# Altium project Serializer_Board.PrjPcb (part 2 of 2)

## Sheet FPGA_Bank.SchDoc
size A2; SheetNumber: 6; SheetTotal: 6
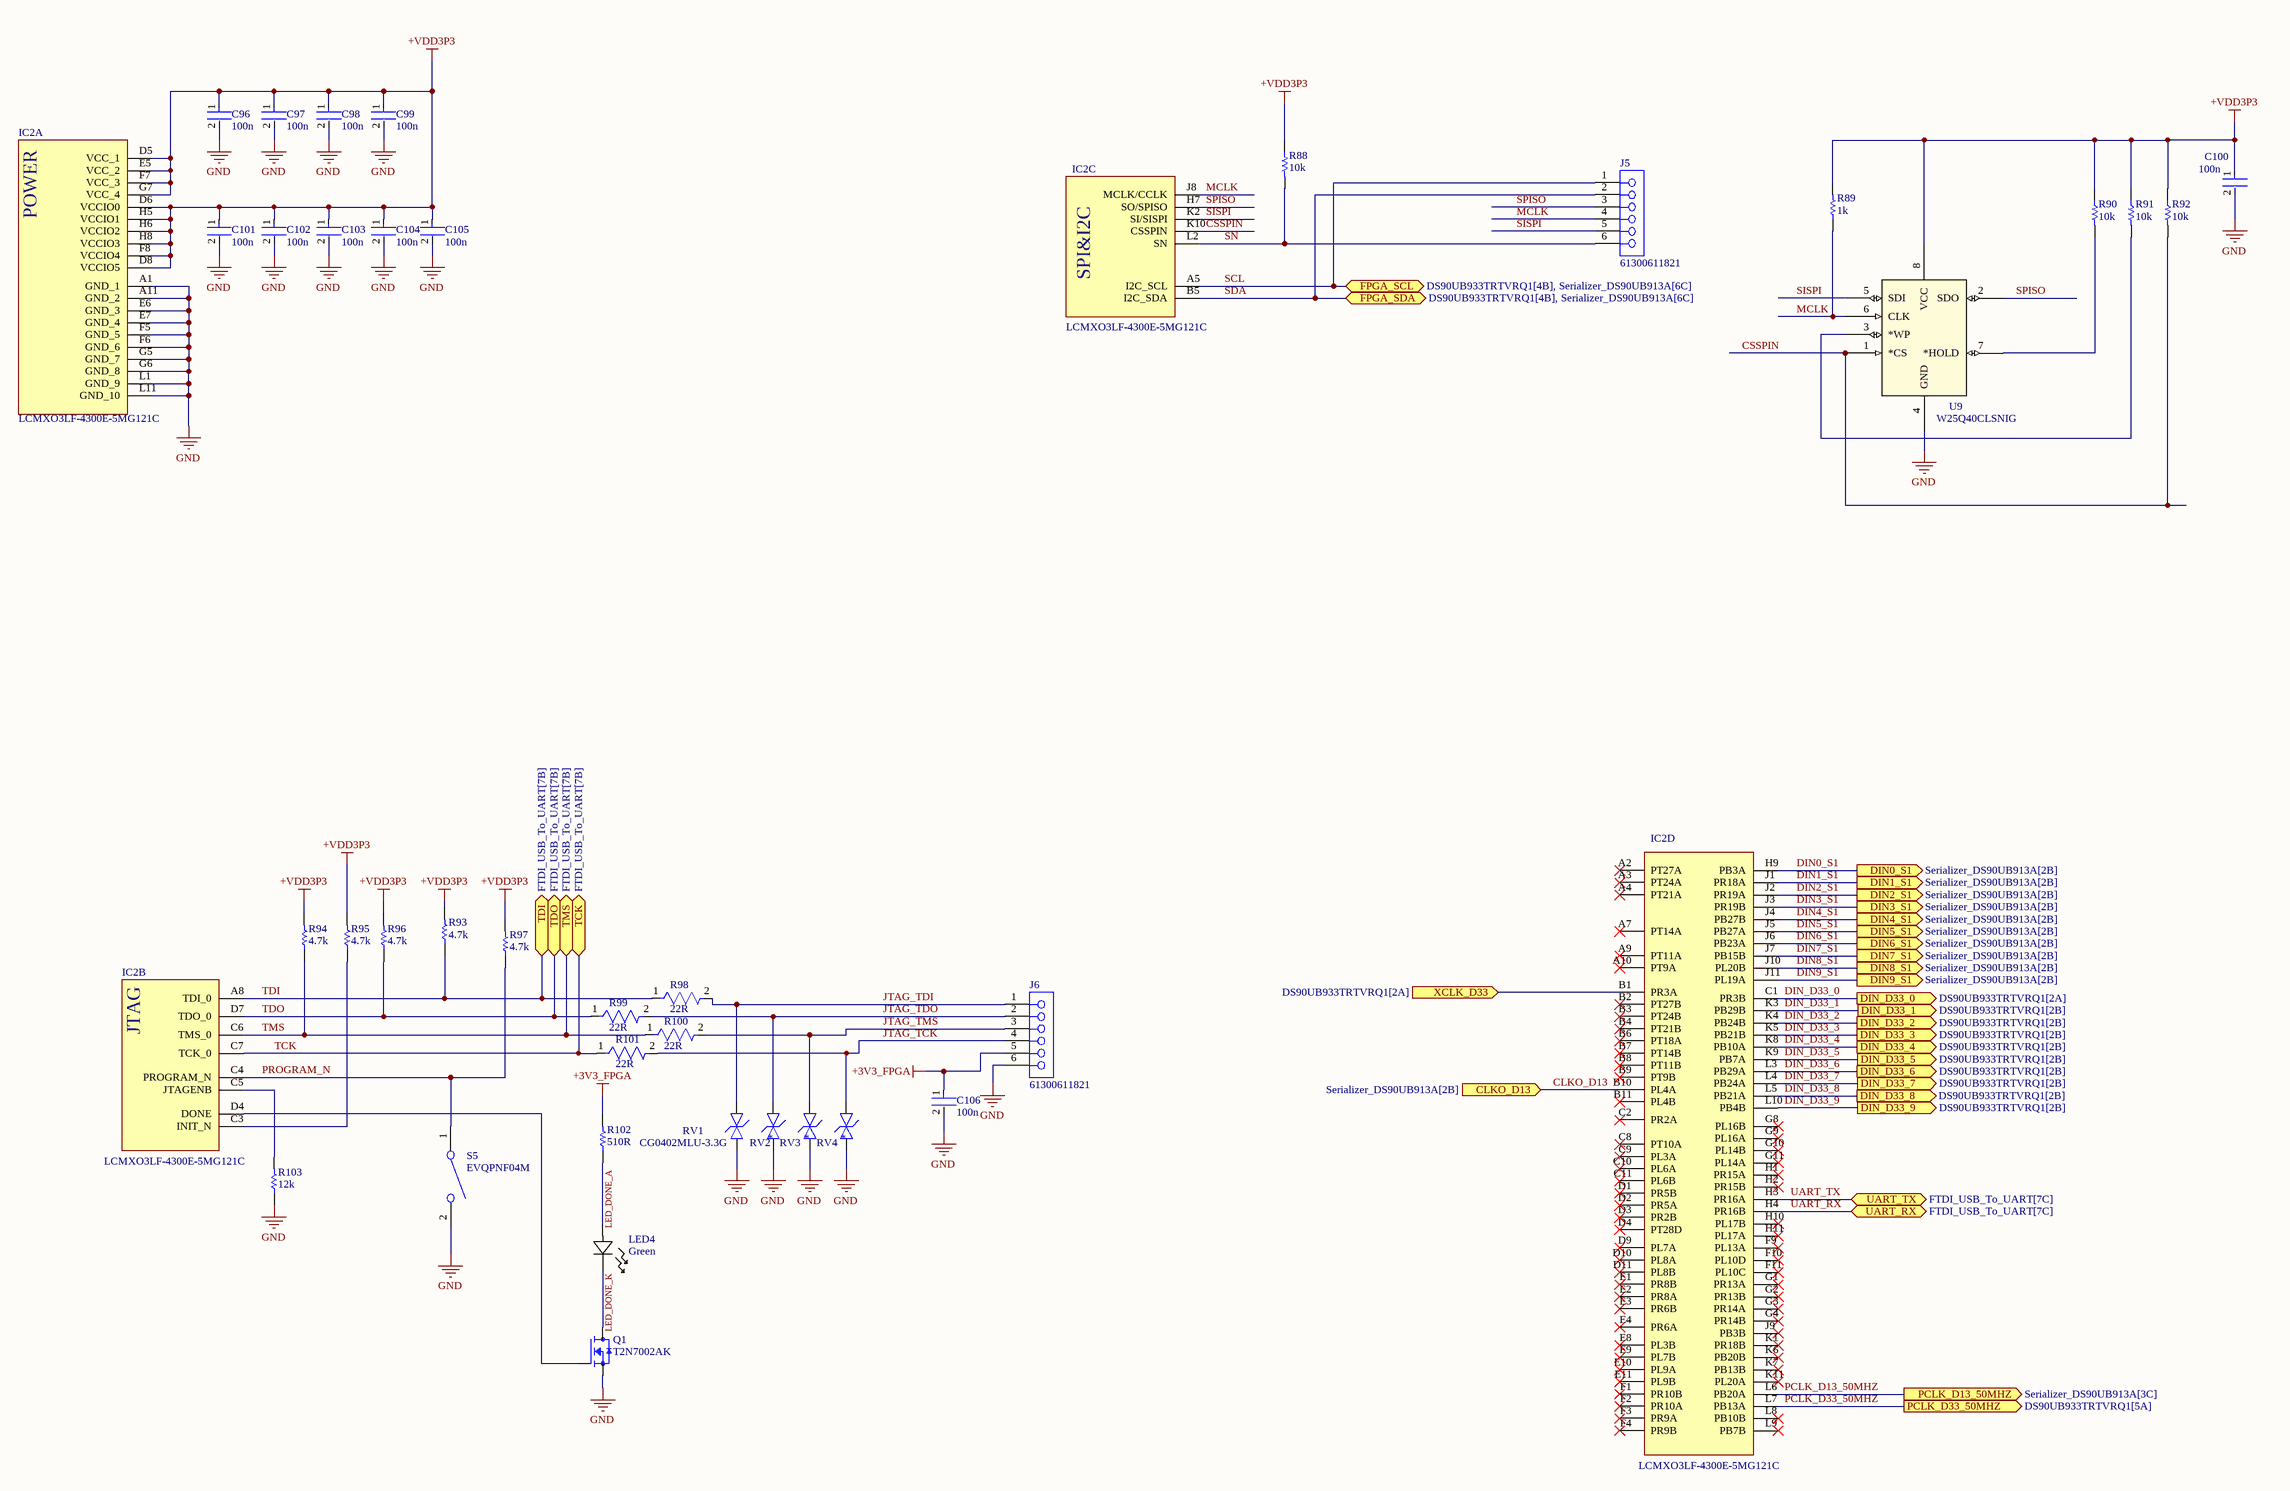
[diagram p4: FPGA_Bank.SchDoc]

### Parts
C96  100n  [FP-CL278-IPC_C]
C97  100n  [FP-CL278-IPC_C]
C98  100n  [FP-CL278-IPC_C]
C99  100n  [FP-CL278-IPC_C]
C100  100n  [FP-CL278-IPC_C]
C101  100n  [FP-CL278-IPC_C]
C102  100n  [FP-CL278-IPC_C]
C103  100n  [FP-CL278-IPC_C]
C104  100n  [FP-CL278-IPC_C]
C105  100n  [FP-CL278-IPC_C]
C106  100n  [FP-CL278-IPC_C]
IC2  LCMXO3LF-4300E-5MG121C  [CSFBGA-121_L6.0-W6.0-R11-C11-P0.50-TL]  (parts A,B,C,D of 4)
J5  61300611821  [61300611821]
J6  61300611821  [61300611821]
LED4  Green  [LED_LTW-C193TS5_LTO]
Q1  T2N7002AK  [SOT-23_TOS]
R88  10k  [RESC1005X40X25ML05T10]
R89  1k  [RESC1005X40X25NL05T05]
R90  10k  [RESC1005X40X25ML05T10]
R91  10k  [RESC1005X40X25ML05T10]
R92  10k  [RESC1005X40X25ML05T10]
R93  4.7k  [RESC1005X40X25LL05T05]
R94  4.7k  [RESC1005X40X25LL05T05]
R95  4.7k  [RESC1005X40X25LL05T05]
R96  4.7k  [RESC1005X40X25LL05T05]
R97  4.7k  [RESC1005X40X25LL05T05]
R98  22R  [FP-RC0402-0_4-MFG]
R99  22R  [FP-RC0402-0_4-MFG]
R100  22R  [FP-RC0402-0_4-MFG]
R101  22R  [FP-RC0402-0_4-MFG]
R102  510R  [RESC1005X40X25LL05T05]
R103  12k  [RESC1005X40X25NL05T10]
RV1  CG0402MLU-3.3G  [VARC1005X41N]
RV2  *  [VARC1005X41N]
RV3  *  [VARC1005X41N]
RV4  *  [VARC1005X41N]
S5  EVQPNF04M  [EVQ5PN05K]
U9  W25Q40CLSNIG  [WIN_SN-8_WIN]

### Ports
CLKO_D13 (in, see Serializer_DS90UB913A[2B]), DIN0_S1 (out, see Serializer_DS90UB913A[2B]), DIN1_S1 (out, see Serializer_DS90UB913A[2B]), DIN2_S1 (out, see Serializer_DS90UB913A[2B]), DIN3_S1 (out, see Serializer_DS90UB913A[2B]), DIN4_S1 (out, see Serializer_DS90UB913A[2B]), DIN5_S1 (out, see Serializer_DS90UB913A[2B]), DIN6_S1 (out, see Serializer_DS90UB913A[2B]), DIN7_S1 (out, see Serializer_DS90UB913A[2B]), DIN8_S1 (out, see Serializer_DS90UB913A[2B]), DIN9_S1 (out, see Serializer_DS90UB913A[2B]), DIN_D33_0 (out, see DS90UB933TRTVRQ1[2A]), DIN_D33_1 (out, see DS90UB933TRTVRQ1[2B]), DIN_D33_2 (out, see DS90UB933TRTVRQ1[2B]), DIN_D33_3 (out, see DS90UB933TRTVRQ1[2B]), DIN_D33_4 (out, see DS90UB933TRTVRQ1[2B]), DIN_D33_5 (out, see DS90UB933TRTVRQ1[2B]), DIN_D33_6 (out, see DS90UB933TRTVRQ1[2B]), DIN_D33_7 (out, see DS90UB933TRTVRQ1[2B]), DIN_D33_8 (out, see DS90UB933TRTVRQ1[2B]), DIN_D33_9 (out, see DS90UB933TRTVRQ1[2B]), FPGA_SCL (bidir, see DS90UB933TRTVRQ1[4B], Serializer_DS90UB913A[6C]), FPGA_SDA (bidir, see DS90UB933TRTVRQ1[4B], Serializer_DS90UB913A[6C]), PCLK_D13_50MHZ (out, see Serializer_DS90UB913A[3C]), PCLK_D33_50MHZ (out, see DS90UB933TRTVRQ1[5A]), TCK (bidir, see FTDI_USB_To_UART[7B]), TDI (bidir, see FTDI_USB_To_UART[7B]), TDO (bidir, see FTDI_USB_To_UART[7B]), TMS (bidir, see FTDI_USB_To_UART[7B]), UART_RX (bidir, see FTDI_USB_To_UART[7C]), UART_TX (bidir, see FTDI_USB_To_UART[7C]), XCLK_D33 (in, see DS90UB933TRTVRQ1[2A])

### Nets
+3V3_FPGA: C106.1 J6.5 R102.2
+VDD3P3: C96.1 C97.1 C98.1 C99.1 C100.1 C101.1 C102.1 C103.1 C104.1 C105.1 IC2.D5(VCC_1) IC2.D6(VCCIO0) IC2.D8(VCCIO5) IC2.E5(VCC_2) IC2.F7(VCC_3) IC2.F8(VCCIO4) IC2.G7(VCC_4) IC2.H5(VCCIO1) IC2.H6(VCCIO2) IC2.H8(VCCIO3) R88.1 R89.2 R90.1 R91.1 R92.1 R93.2 R94.2 R95.2 R96.2 R97.2 U9.8(VCC)
GND: C96.2 C97.2 C98.2 C99.2 C100.2 C101.2 C102.2 C103.2 C104.2 C105.2 C106.2 IC2.A1(GND_1) IC2.A11(GND_2) IC2.E6(GND_3) IC2.E7(GND_4) IC2.F5(GND_5) IC2.F6(GND_6) IC2.G5(GND_7) IC2.G6(GND_8) IC2.L1(GND_9) IC2.L11(GND_10) J6.6 Q1.2(S) R103.1 RV1.A RV2.A RV3.A RV4.A S5.2(NO) U9.4(GND)
CLKO_D13: IC2.B10(PL4A) ; port CLKO_D13
CSSPIN: IC2.K10(CSSPIN) R92.2 U9.1(*CS)  [project net CSSPIN_6]
DIN0_S1: IC2.H9(PB3A) ; port DIN0_S1
DIN1_S1: IC2.J1(PR18A) ; port DIN1_S1
DIN2_S1: IC2.J2(PR19A) ; port DIN2_S1
DIN3_S1: IC2.J3(PR19B) ; port DIN3_S1
DIN4_S1: IC2.J4(PB27B) ; port DIN4_S1
DIN5_S1: IC2.J5(PB27A) ; port DIN5_S1
DIN6_S1: IC2.J6(PB23A) ; port DIN6_S1
DIN7_S1: IC2.J7(PB15B) ; port DIN7_S1
DIN8_S1: IC2.J10(PL20B) ; port DIN8_S1
DIN9_S1: IC2.J11(PL19A) ; port DIN9_S1
DIN_D33_0: IC2.C1(PR3B) ; port DIN_D33_0
DIN_D33_1: IC2.K3(PB29B) ; port DIN_D33_1
DIN_D33_2: IC2.K4(PB24B) ; port DIN_D33_2
DIN_D33_3: IC2.K5(PB21B) ; port DIN_D33_3
DIN_D33_4: IC2.K8(PB10A) ; port DIN_D33_4
DIN_D33_5: IC2.K9(PB7A) ; port DIN_D33_5
DIN_D33_6: IC2.L3(PB29A) ; port DIN_D33_6
DIN_D33_7: IC2.L4(PB24A) ; port DIN_D33_7
DIN_D33_8: IC2.L5(PB21A) ; port DIN_D33_8
DIN_D33_9: IC2.L10(PB4B) ; port DIN_D33_9
JTAG_TCK: J6.4 R101.2 RV4.K  [project net JTAG_TCK_6]
JTAG_TDI: J6.1 R98.2 RV1.K  [project net JTAG_TDI_6]
JTAG_TDO: J6.2 R99.2 RV2.K  [project net JTAG_TDO_6]
JTAG_TMS: J6.3 R100.2 RV3.K  [project net JTAG_TMS_6]
LED_DONE_A: LED4.2 R102.1  [project net LED_DONE_A_6]
LED_DONE_K: LED4.1 Q1.3(D)  [project net LED_DONE_K_6]
MCLK: IC2.J8(MCLK/CCLK) J5.4 R89.1 U9.6(CLK)  [project net MCLK_6]
PCLK_D13_50MHZ: IC2.L6(PB20A) ; port PCLK_D13_50MHZ
PCLK_D33_50MHZ: IC2.L7(PB13A) ; port PCLK_D33_50MHZ
PROGRAM_N: IC2.C4(PROGRAM_N) R97.1 S5.1(COM)  [project net PROGRAM_N_6]
SCL: IC2.A5(I2C_SCL) J5.1 ; port FPGA_SCL
SDA: IC2.B5(I2C_SDA) J5.2 ; port FPGA_SDA
SISPI: IC2.K2(SI/SISPI) J5.5 U9.5(SDI)  [project net SISPI_6]
SN: IC2.L2(SN) J5.6 R88.2  [project net SN_6]
SPISO: IC2.H7(SO/SPISO) J5.3 U9.2(SDO)  [project net SPISO_6]
TCK: IC2.C7(TCK_0) R101.1 ; port TCK
TDI: IC2.A8(TDI_0) R93.1 R98.1 ; port TDI
TDO: IC2.D7(TDO_0) R96.1 R99.1 ; port TDO
TMS: IC2.C6(TMS_0) R94.1 R100.1 ; port TMS
UART_RX: IC2.H4(PR16B) ; port UART_RX
UART_TX: IC2.H3(PR16A) ; port UART_TX
NetIC2_B1: IC2.B1(PR3A) ; port XCLK_D33
NetIC2_C3: IC2.C3(INIT_N) R95.1
NetIC2_C5: IC2.C5(JTAGENB) R103.2
NetIC2_D4: IC2.D4(DONE) Q1.1(G)
NetR90_2: R90.2 U9.7(*HOLD)
NetR91_2: R91.2 U9.3(*WP)

Not connected (* = marked no-connect by the designer): IC2 A2(PT27A)* A3(PT24A)* A4(PT21A)* A7(PT14A)* A9(PT11A)* A10(PT9A)* B2(PT27B)* B3(PT24B)* B4(PT21B)* B6(PT18A)* B7(PT14B)* B8(PT11B)* B9(PT9B)* B11(PL4B)* C2(PR2A)* C8(PT10A)* C9(PL3A)* C10(PL6A)* C11(PL6B)* D1(PR5B)* D2(PR5A)* D3(PR2B)* D9(PL7A)* D10(PL8A)* D11(PL8B)* E1(PR8B)* E2(PR8A)* E3(PR6B)* E4(PR6A)* E8(PL3B)* E9(PL7B)* E10(PL9A)* E11(PL9B)* F1(PR10B)* F2(PR10A)* F3(PR9A)* F4(PR9B)* F9(PL13A)* F10(PL10D)* F11(PL10C)* G1(PR13A)* G2(PR13B)* G3(PR14A)* G4(PR14B)* G8(PL16B)* G9(PL16A)* G10(PL14B)* G11(PL14A)* H1(PR15A)* H2(PR15B)* H10(PL17B)* H11(PL17A)* J9(PB3B)* K1(PR18B)* K6(PB20B)* K7(PB13B)* K11(PL20A)* L8(PB10B)* L9(PB7B)*

### Notes on the sheet
- (in symbol LCMXO3LF-4300E-5MG121C, part A) POWER
- (in symbol LCMXO3LF-4300E-5MG121C, part B) JTAG
- (in symbol LCMXO3LF-4300E-5MG121C, part C) SPI&I2C

### Library data of the parts
C96-C106 = CMP-13271-000728-1: Cap Ceramic 100nF 25V X5R ±10% SMD 0402 +85°C Paper T/R; Package Quantity: 1; Height: 0.5mm; Case Code (Metric): 1005; Thickness: 0.022inch; Mount: Surface Mount; Lead Free: Lead Free; Case Code (Imperial): 0402; Packaging: Tape and Reel; Depth: 0.5mm; Voltage: 25V; Min Operating Temperature: -55°C; Voltage Rating: 25V; Dielectric: X5R; Case/Package: 0402; Tolerance: 10%; Width: 0.02inch; Max Operating Temperature: 85°C; Capacitance: 100nF; Length: 1mm; Radiation Hardening: No; Voltage Rating (DC): 25V
IC2 = LCMXO3LF-4300E-5MG121C: FPGA IC; Manufacturer_Name: Lattice Semiconductor; Datasheet Link: https://www.latticesemi.com/MachXO3; Height: 1mm; Manufacturer_Part_Number: LCMXO3LF-4300E-5MG121C; Mouser Part Number: 842-O3LF4300E5MG121C; Mouser Price/Stock: https://www.mouser.co.uk/ProductDetail/Lattice/LCMXO3LF-4300E-5MG121C?qs=Zwj7mHVHPHTjqjc5ga7IUA%3D%3D; Arrow Part Number: LCMXO3LF-4300E-5MG121C; Arrow Price/Stock: https://www.arrow.com/en/products/lcmxo3lf-4300e-5mg121c/lattice-semiconductor?region=nac
J5 J6 = CMP-1502-01322-4: THT Vertical Socket Header WR-PHD, Pitch 2.54 mm, Single Row, 6 pins; Current Rating: 3A; Contact Resistance: 20mΩ; Gender: Female; Operating Supply Voltage: 250V; RoHS: Compliant; Orientation: Vertical; Number of Pins: 6; Lead Pitch: 2.54mm
LED4 = LTST-C191TGKT: No Description Available; Manufacturer_Name: LITE-ON; Copyright: Copyright (C) 2025 Ultra Librarian. All rights reserved.; Manufacturer_Part_Number: LTST-C191TGKT
Q1 = T2N7002AK: N-ch MOSFET, 60 V, 0.2 A, 3.9 Î©@10V, SOT-23(SOT23); Manufacturer_Name: Toshiba Electronic Devices & Storage Corp.; Copyright: Copyright (C) 2025 Ultra Librarian. All rights reserved.; Manufacturer_Part_Number: T2N7002AK; RefDes: RefDes; Type: Type
R88 R90-R92 = CMP-2002-03043-1: Part Number: CRCW040210K0FKEDHP; Manufacturer: Vishay Dale
R89 = CMP-1011-00510-4: Chip Resistor, 1 KOhm, +/- 1%, 100 mW, -55 to 155 degC, 0402 (1005 Metric), RoHS, Tape and Reel; PartNumber: ERJ-2RKF1001X; Manufacturer: Basic Passives; Voltage Rating: 50 V; Case\/Package: 0402; Resistance: 1 KOhm; Power Rating: 100 mW; DatasheetVersion: 04/2015; Radiation Hardening: No; Pins: 2; Height: 0.35 mm; RoHSCompliant: true; Case Code (Imperial): 0402; ComponentLink2Description: Datasheet; ComponentLink1Description: Manufacturer URL; PackageReference: 0402; Mount: Surface Mount; Package Quantity: 10000; Tolerance: 1%; ComponentLink1URL: http://www.panasonic.com/; PackageDescription: 2-Pin Surface Mount Device, Body 1 x 0.5 mm; Mounting Technology: Surface Mount; Case Code (Metric): 1005; ComponentLink2URL: http://industrial.panasonic.com/cdbs/www-data/pdf/RDA0000/AOA0000C86.pdf; REACH SVHC: Yes; Packaging: Tape and Reel; Max Operating Temperature: 155 degC; Min Operating Temperature: -55 degC; Width: 0.5 mm; Length: 1 mm
R93-R97 = CMP-2002-01154-4: Chip Resistor, 4.7 KOhm, +/- 1%, 0.1 W, -55 to 155 degC, 0402 (1005 Metric), RoHS, Tape and Reel; PartNumber: ERJ-2RKF4701X; Voltage Rating: 50 V; Case\/Package: 0402; Power Rating: 100 mW; Height: 0.35 mm; Mounting Technology: Surface Mount; REACH SVHC: Yes; Resistance: 4.7 KOhm; Max Operating Temperature: 155 degC; ComponentLink1Description: Manufacturer URL; ComponentLink2Description: Datasheet; Pins: 2; PackageReference: 0402; Tolerance: 1%; Case Code (Imperial): 0402; Length: 1 mm; PackageDescription: 2-Pin Surface Mount Device, Body 1 x 0.5 mm; RoHSCompliant: true; Package Quantity: 1; Radiation Hardening: No; DatasheetVersion: 04/2015; Width: 0.5 mm; Case Code (Metric): 1005; Mount: Surface Mount; ComponentLink1URL: http://www.panasonic.com/; Min Operating Temperature: -55 degC; Packaging: Cut Tape; ComponentLink2URL: http://industrial.panasonic.com/cdbs/www-data/pdf/RDA0000/AOA0000C86.pdf
R98-R101 = CMP-2002-07520-2: Tolerance: 1%; Power Rating: 63mW; Voltage Rating: 50V; Temperature Coefficient: 100ppm/°C; Resistance: 22Ω; Termination: SMD/SMT; Depth: 500µm; Packaging: Tape & Reel; Height: 400µm; Width: 500µm; Case Code (Imperial): 0402; Length: 1mm; Schedule B: 8533210045, 8533210045; Case/Package: 0402; Max Operating Temperature: 155°C; Min Operating Temperature: -55°C; REACH SVHC: Unknown; RoHS: Compliant; Military Standard: Not; Voltage Rating (DC): 50V; Lead Free: Lead Free; Voltage Rating (AC): 50V; Number of Pins: 2; Composition: Thick Film
R102 = CMP-2002-00074-1: Part Number: CRCW0402510RFKED; Manufacturer: Vishay Dale
R103 = CMP-2002-07343-1: Part Number: RC0402FR-07100KL; Manufacturer: Yageo / Phycomp
RV1-RV4 = CG0402MLU-3.3G: Varistor; Manufacturer_Name: Bourns; Datasheet Link: https://www.bourns.com/docs/Product-Datasheets/MLU.pdf; Height: 0.41mm; Manufacturer_Part_Number: CG0402MLU-3.3G; Mouser Part Number: 652-CG0402MLU-3.3G; Mouser Price/Stock: https://www.mouser.co.uk/ProductDetail/Bourns/CG0402MLU-3.3G?qs=m8myXnDJXpWVM8EQWErxtQ%3D%3D; Arrow Part Number: CG0402MLU-3.3G; Arrow Price/Stock: https://www.arrow.com/en/products/cg0402mlu-3.3g/bourns?utm_currency=USD&region=nac
S5 = EVQPNF04M: Switch; Manufacturer_Name: Panasonic; Datasheet Link: https://industrial.panasonic.com/cdbs/www-data/pdf/ATK0000/ATK0000C376.pdf; Manufacturer_Part_Number: EVQPNF04M
U9 = W25Q40CLSNIG: No Description Available; Manufacturer_Name: Winbond; Copyright: Copyright (C) 2026 Ultra Librarian. All rights reserved.; Manufacturer_Part_Number: W25Q40CLSNIG; RefDes: RefDes; Type: Type

## Nets that join several sheets
+1.8_USB: PowerToSer (C54.2 C55.1 R50.2 U5.3), FTDI_USB_To_UART (8 pins)
+3V3_USB: PowerToSer (C42.2 C43.1 R42.2 U3.3), FTDI_USB_To_UART (21 pins)
+5V_USB: PowerToSer (9 pins), FTDI_USB_To_UART (C91.1 FB8.1 J4.1)
+VDD5V: Serializer_DS90UB913A (C16.2 C17.1 FB2.2), BuckRegulatorOnSer (R29.2)
GND: Serializer_DS90UB913A (45 pins), BuckRegulatorOnSer (24 pins), PowerToSer (35 pins), FTDI_USB_To_UART (32 pins), FPGA_Bank (30 pins)
VDD1P8: Serializer_DS90UB913A (12 pins), PowerToSer (C50.2 C51.1 R49.2 U4.3)
VDD3P3: Serializer_DS90UB913A (5 pins), BuckRegulatorOnSer (6 pins), PowerToSer (9 pins)
CLKO_D13: Serializer_DS90UB913A (R11.1 U1.17), FPGA_Bank (IC2.B10)
DIN0_S1: Serializer_DS90UB913A (R1.1 U1.19), FPGA_Bank (IC2.H9)
DIN1_S1: Serializer_DS90UB913A (R2.1 U1.20), FPGA_Bank (IC2.J1)
DIN2_S1: Serializer_DS90UB913A (R3.1 U1.21), FPGA_Bank (IC2.J2)
DIN3_S1: Serializer_DS90UB913A (R4.1 U1.22), FPGA_Bank (IC2.J3)
DIN4_S1: Serializer_DS90UB913A (R5.1 U1.23), FPGA_Bank (IC2.J4)
DIN5_S1: Serializer_DS90UB913A (R6.1 U1.24), FPGA_Bank (IC2.J5)
DIN6_S1: Serializer_DS90UB913A (R7.1 U1.26), FPGA_Bank (IC2.J6)
DIN7_S1: Serializer_DS90UB913A (R8.1 U1.27), FPGA_Bank (IC2.J7)
DIN8_S1: Serializer_DS90UB913A (R9.1 U1.29), FPGA_Bank (IC2.J10)
DIN9_S1: Serializer_DS90UB913A (R10.1 U1.30), FPGA_Bank (IC2.J11)
NetR15_2: Serializer_DS90UB913A (R15.2), PowerToSer (Y1.3)
PCLK_D13_50MHZ: Serializer_DS90UB913A (U1.3), FPGA_Bank (IC2.L6)
SCL: Serializer_DS90UB913A (R23.1), FPGA_Bank (IC2.A5 J5.1)
SDA: Serializer_DS90UB913A (R26.1), FPGA_Bank (IC2.B5 J5.2)
TCK: FTDI_USB_To_UART (R72.2), FPGA_Bank (IC2.C7 R101.1)
TDI: FTDI_USB_To_UART (R73.2), FPGA_Bank (IC2.A8 R93.1 R98.1)
TDO: FTDI_USB_To_UART (R74.2), FPGA_Bank (IC2.D7 R96.1 R99.1)
TMS: FTDI_USB_To_UART (R75.2), FPGA_Bank (IC2.C6 R94.1 R100.1)
UART_RX: FTDI_USB_To_UART (R80.2), FPGA_Bank (IC2.H4)
UART_TX: FTDI_USB_To_UART (R78.2), FPGA_Bank (IC2.H3)